# EAGLE schematic flash_adc (EAGLE 9.2.2)
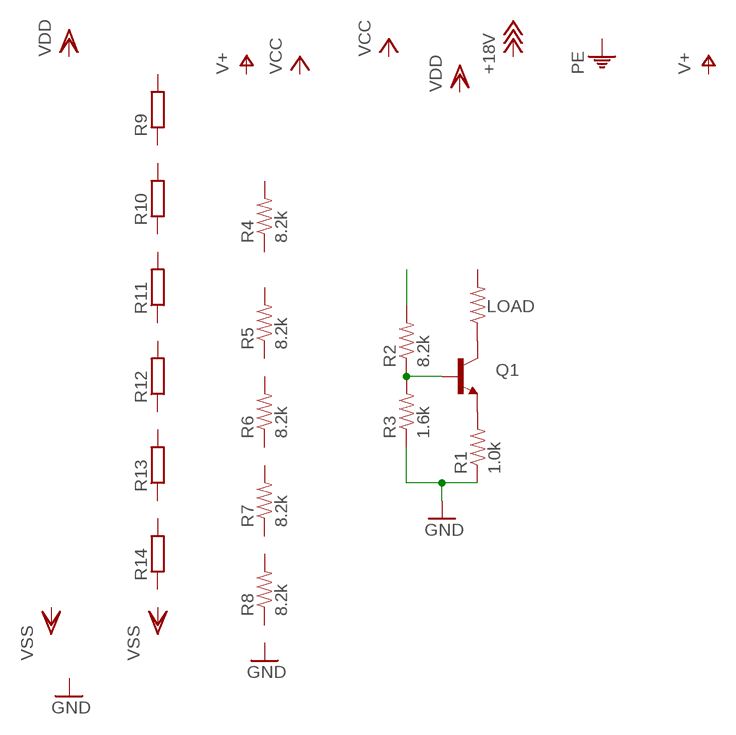
[diagram p0: schematic, sheet 1]

## Parts
LOAD  RESISTOR0402-RES  [0402-RES]
Q1  TRANSISTOR_NPN"  [SOT223]
R1  1.0k  RESISTOR0402-RES  [0402-RES]
R2  8.2k  RESISTOR0402-RES  [0402-RES]
R3  1.6k  RESISTOR0402-RES  [0402-RES]
R4  8.2k  RESISTOR0402-RES  [0402-RES]
R5  8.2k  RESISTOR0402-RES  [0402-RES]
R6  8.2k  RESISTOR0402-RES  [0402-RES]
R7  8.2k  RESISTOR0402-RES  [0402-RES]
R8  8.2k  RESISTOR0402-RES  [0402-RES]
R9  R-EU_R0805  [R0805]
R10  R-EU_R0805  [R0805]
R11  R-EU_R0805  [R0805]
R12  R-EU_R0805  [R0805]
R13  R-EU_R0805  [R0805]
R14  R-EU_R0805  [R0805]

## Nets
GND: R1.1 R3.1
N$1: Q1.3(E) R1.2
N$2: Q1.1(B) R2.1 R3.2
N$3: LOAD.1 Q1.2(C)
N$5: R2.2
Unconnected: LOAD.2 R4.1 R4.2 R5.1 R5.2 R6.1 R6.2 R7.1 R7.2 R8.1 R8.2 R9.1 R9.2 R10.1 R10.2 R11.1 R11.2 R12.1 R12.2 R13.1 R13.2 R14.1 R14.2

## Library data of the parts
LOAD R1-R8 = SparkFun-Resistors:RESISTOR: Resistor Basic schematic elements and footprints for 0603, 1206, and PTH resistors.
Q1 = SparkFun-DiscreteSemi:TRANSISTOR_NPN: Generic NPN BJT. MMBT2222 is the common NPN we use. Double check against datasheet- not all devices are the same!
R9-R14 = rcl:R-EU_: RESISTOR, European symbol; SPICEPREFIX: R